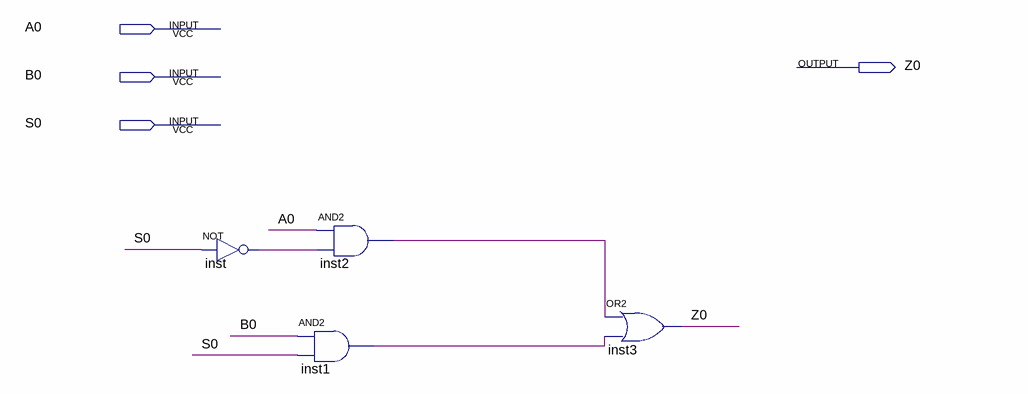
[diagram p0: schematic sheet]
// Quartus schematic BlocoMux.bdf as structural Verilog: 4 symbols, 4 pins
module BlocoMux (
  input  A0,
  input  B0,
  input  S0,
  output Z0
);

  wire inst1_out, inst2_out, inst_out;

  not inst (inst_out, S0);
  and inst1 (inst1_out, B0, S0);
  and inst2 (inst2_out, A0, inst_out);
  or inst3 (Z0, inst2_out, inst1_out);
endmodule
